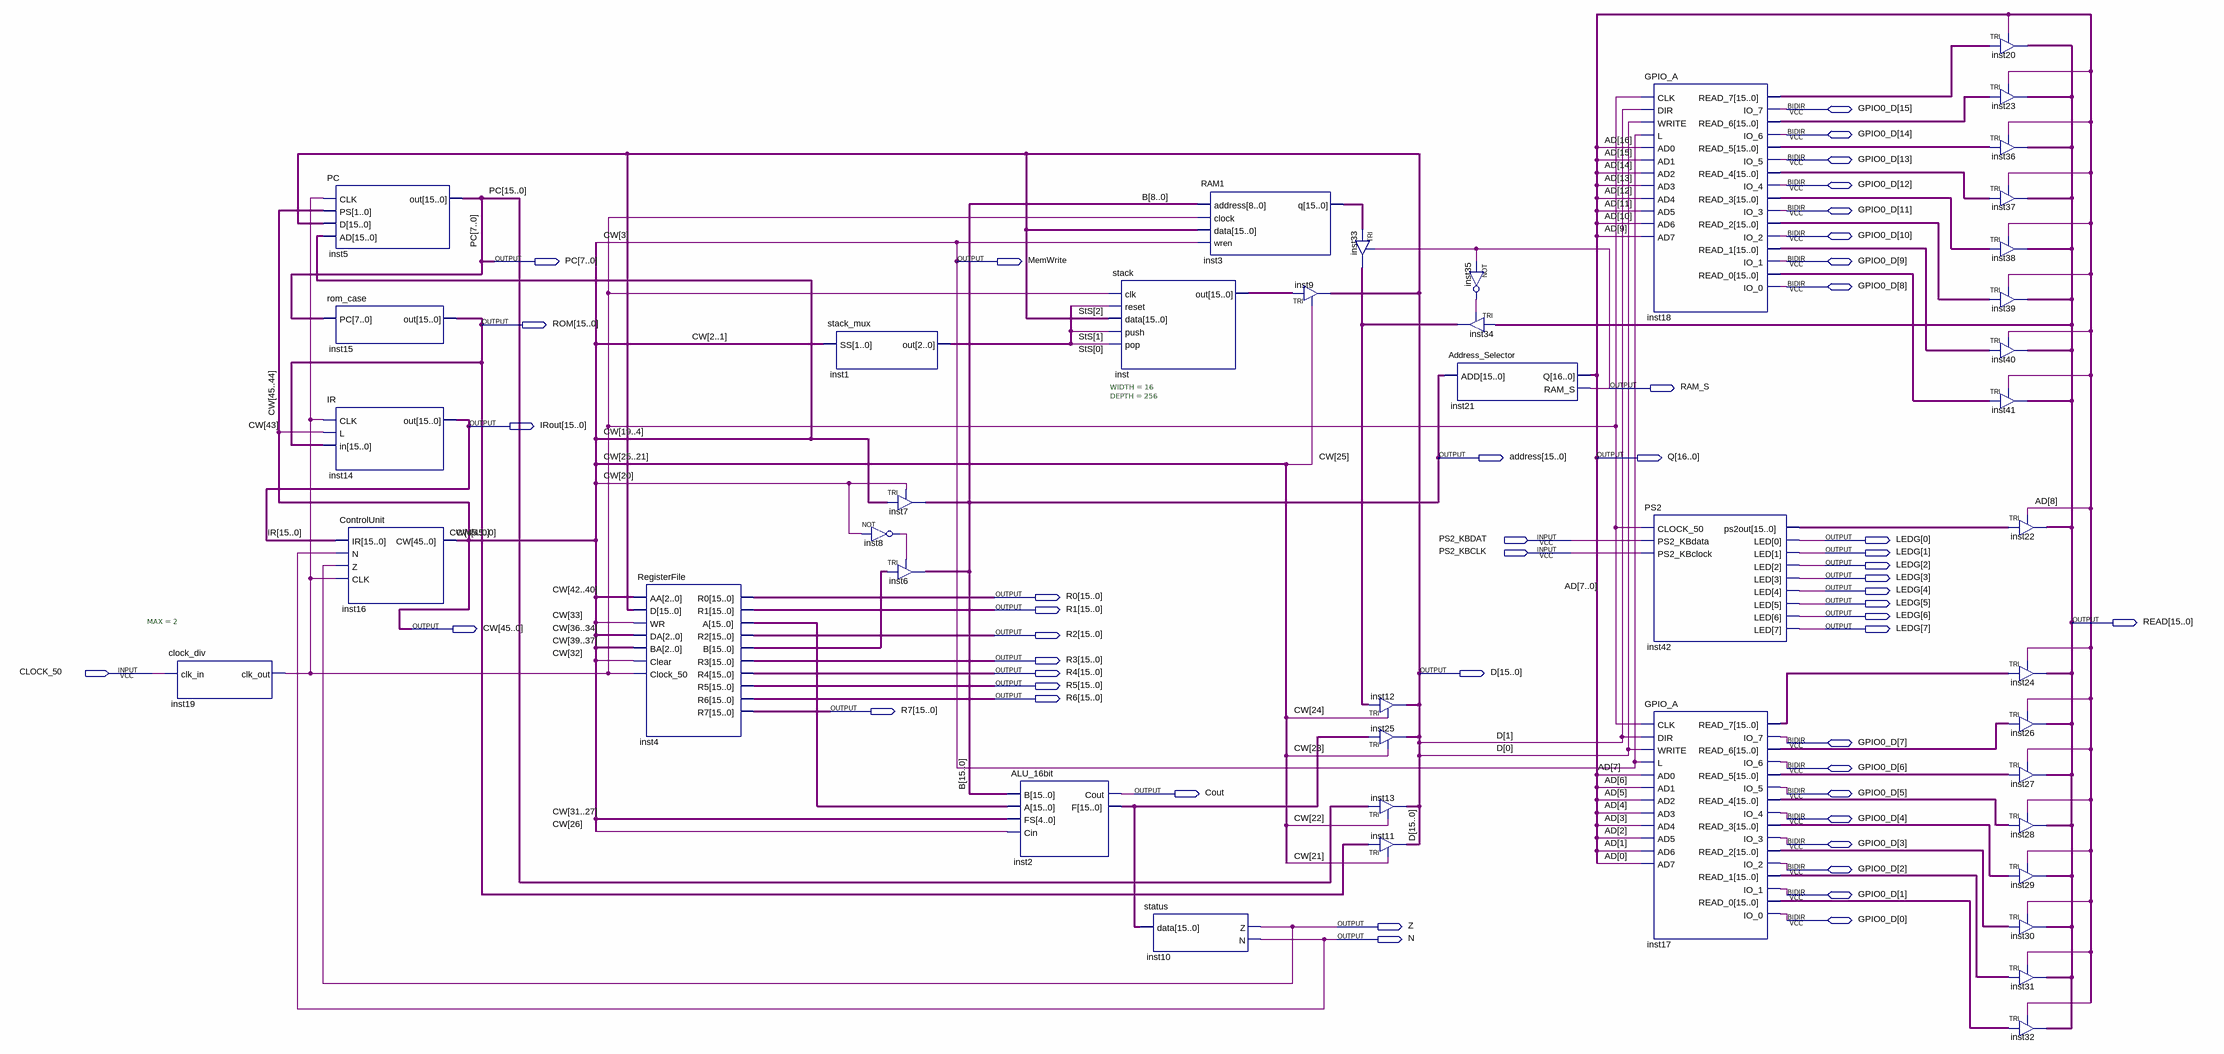
[diagram p0: schematic sheet]
// Quartus schematic Core.bdf as structural Verilog: 43 symbols, 48 pins
module Core (
  input  PS2_KBDAT,
  input  PS2_KBCLK,
  input  CLOCK_50,
  inout  [15:0] GPIO0_D,
  output [15:0] PC,
  output MemWrite,
  output [15:0] ROM,
  output RAM_S,
  output [15:0] IRout,
  output [15:0] address,
  output [16:0] Q,
  output [7:0] LEDG,
  output [15:0] R0,
  output [15:0] R1,
  output [15:0] READ,
  output [45:0] CW,
  output [15:0] R2,
  output [15:0] R3,
  output [15:0] R4,
  output [15:0] D,
  output [15:0] R5,
  output [15:0] R6,
  output [15:0] R7,
  output Cout,
  output Z,
  output N
);

  wire inst8_out, inst19_clk_out, inst35_out;
  wire [2:0] StS;
  wire [15:0] inst2_f, inst3_q, inst4_a, inst4_b, inst17_read_0, inst17_read_1, inst17_read_2, inst17_read_3,
       inst17_read_4, inst17_read_5, inst17_read_6, inst17_read_7, inst18_read_0, inst18_read_1,
       inst18_read_2, inst18_read_3, inst18_read_4, inst18_read_5, inst18_read_6, inst18_read_7, inst33_out,
       inst42_ps2out, inst_out;

  clock_div #(.MAX(2)) inst19 (.clk_in(CLOCK_50), .clk_out(inst19_clk_out));
  PC inst5 (.CLK(inst19_clk_out), .PS(CW[45:44]), .D(D), .AD(CW[19:4]), .out(PC));
  rom_case inst15 (.PC(PC[7:0]), .out(ROM));
  IR inst14 (.CLK(inst19_clk_out), .L(CW[43]), .in(ROM), .out(IRout));
  ControlUnit inst16 (.IR(IRout), .N(N), .Z(Z), .CLK(inst19_clk_out), .CW(CW));
  RegisterFile inst4 (
    .AA(CW[42:40]), .D(D), .WR(CW[33]), .DA(CW[36:34]), .BA(CW[39:37]), .Clear(CW[32]),
    .Clock_50(inst19_clk_out), .R0(R0), .R1(R1), .A(inst4_a), .R2(R2), .B(inst4_b), .R3(R3), .R4(R4),
    .R5(R5), .R6(R6), .R7(R7));
  stack_mux inst1 (.SS(CW[2:1]), .out(StS));
  TRI inst7[15:0] (.IN(CW[19:4]), .OE(CW[20]), .OUT(address));
  not inst8 (inst8_out, CW[20]);
  TRI inst6[15:0] (.IN(inst4_b), .OE(inst8_out), .OUT(address));
  ALU_16bit inst2 (.B(address), .A(inst4_a), .FS(CW[31:27]), .Cin(CW[26]), .Cout(Cout), .F(inst2_f));
  stack #(.WIDTH(16), .DEPTH(256)) inst (
    .clk(inst19_clk_out), .reset(StS[2]), .data(D), .push(StS[1]), .pop(StS[0]), .out(inst_out));
  status inst10 (.data(inst2_f), .Z(Z), .N(N));
  RAM1 inst3 (.address(address[8:0]), .clock(inst19_clk_out), .data(D), .wren(CW[3]), .q(inst3_q));
  TRI inst9[15:0] (.IN(inst_out), .OE(CW[25]), .OUT(D));
  TRI inst33[15:0] (.IN(inst3_q), .OE(RAM_S), .OUT(inst33_out));
  TRI inst12[15:0] (.IN(inst33_out), .OE(CW[24]), .OUT(D));
  TRI inst25[15:0] (.IN(inst2_f), .OE(CW[23]), .OUT(D));
  TRI inst13[15:0] (.IN(PC), .OE(CW[22]), .OUT(D));
  TRI inst11[15:0] (.IN(ROM), .OE(CW[21]), .OUT(D));
  TRI inst34[15:0] (.IN(READ), .OE(inst35_out), .OUT(inst33_out));
  Address_Selector inst21 (.ADD(address), .Q(Q), .RAM_S(RAM_S));
  not inst35 (inst35_out, RAM_S);
  GPIO_A inst18 (
    .CLK(inst19_clk_out), .DIR(D[1]), .WRITE(D[0]), .L(CW[3]), .AD0(Q[16]), .AD1(Q[15]), .AD2(Q[14]),
    .AD3(Q[13]), .AD4(Q[12]), .AD5(Q[11]), .AD6(Q[10]), .AD7(Q[9]), .READ_7(inst18_read_7),
    .READ_6(inst18_read_6), .READ_5(inst18_read_5), .READ_4(inst18_read_4), .READ_3(inst18_read_3),
    .READ_2(inst18_read_2), .READ_1(inst18_read_1), .READ_0(inst18_read_0), .IO_7(GPIO0_D[15]),
    .IO_6(GPIO0_D[14]), .IO_5(GPIO0_D[13]), .IO_4(GPIO0_D[12]), .IO_3(GPIO0_D[11]), .IO_2(GPIO0_D[10]),
    .IO_1(GPIO0_D[9]), .IO_0(GPIO0_D[8]));
  PS2 inst42 (
    .CLOCK_50(inst19_clk_out), .PS2_KBdata(PS2_KBDAT), .PS2_KBclock(PS2_KBCLK), .ps2out(inst42_ps2out),
    .LED(LEDG));
  GPIO_A inst17 (
    .CLK(inst19_clk_out), .DIR(D[1]), .WRITE(D[0]), .L(CW[3]), .AD0(Q[7]), .AD1(Q[6]), .AD2(Q[5]),
    .AD3(Q[4]), .AD4(Q[3]), .AD5(Q[2]), .AD6(Q[1]), .AD7(Q[0]), .READ_7(inst17_read_7),
    .READ_6(inst17_read_6), .READ_5(inst17_read_5), .READ_4(inst17_read_4), .READ_3(inst17_read_3),
    .READ_2(inst17_read_2), .READ_1(inst17_read_1), .READ_0(inst17_read_0), .IO_7(GPIO0_D[7]),
    .IO_6(GPIO0_D[6]), .IO_5(GPIO0_D[5]), .IO_4(GPIO0_D[4]), .IO_3(GPIO0_D[3]), .IO_2(GPIO0_D[2]),
    .IO_1(GPIO0_D[1]), .IO_0(GPIO0_D[0]));
  TRI inst20[15:0] (.IN(inst18_read_7), .OE(Q[9]), .OUT(READ));
  TRI inst23[15:0] (.IN(inst18_read_6), .OE(Q[10]), .OUT(READ));
  TRI inst36[15:0] (.IN(inst18_read_5), .OE(Q[11]), .OUT(READ));
  TRI inst37[15:0] (.IN(inst18_read_4), .OE(Q[12]), .OUT(READ));
  TRI inst38[15:0] (.IN(inst18_read_3), .OE(Q[13]), .OUT(READ));
  TRI inst39[15:0] (.IN(inst18_read_2), .OE(Q[14]), .OUT(READ));
  TRI inst40[15:0] (.IN(inst18_read_1), .OE(Q[15]), .OUT(READ));
  TRI inst41[15:0] (.IN(inst18_read_0), .OE(Q[16]), .OUT(READ));
  TRI inst22[15:0] (.IN(inst42_ps2out), .OE(Q[8]), .OUT(READ));
  TRI inst24[15:0] (.IN(inst17_read_7), .OE(Q[0]), .OUT(READ));
  TRI inst26[15:0] (.IN(inst17_read_6), .OE(Q[1]), .OUT(READ));
  TRI inst27[15:0] (.IN(inst17_read_5), .OE(Q[2]), .OUT(READ));
  TRI inst28[15:0] (.IN(inst17_read_4), .OE(Q[3]), .OUT(READ));
  TRI inst29[15:0] (.IN(inst17_read_3), .OE(Q[4]), .OUT(READ));
  TRI inst30[15:0] (.IN(inst17_read_2), .OE(Q[5]), .OUT(READ));
  TRI inst31[15:0] (.IN(inst17_read_1), .OE(Q[6]), .OUT(READ));
  TRI inst32[15:0] (.IN(inst17_read_0), .OE(Q[7]), .OUT(READ));

  assign MemWrite = CW[3];

  // Other names for the same wires on the sheet: AD[16:0] = Q; B[15:0] = address; IR[15:0] = IRout
endmodule
